# EAGLE schematic SMART_RAMPS_1-42 (EAGLE 6.1)
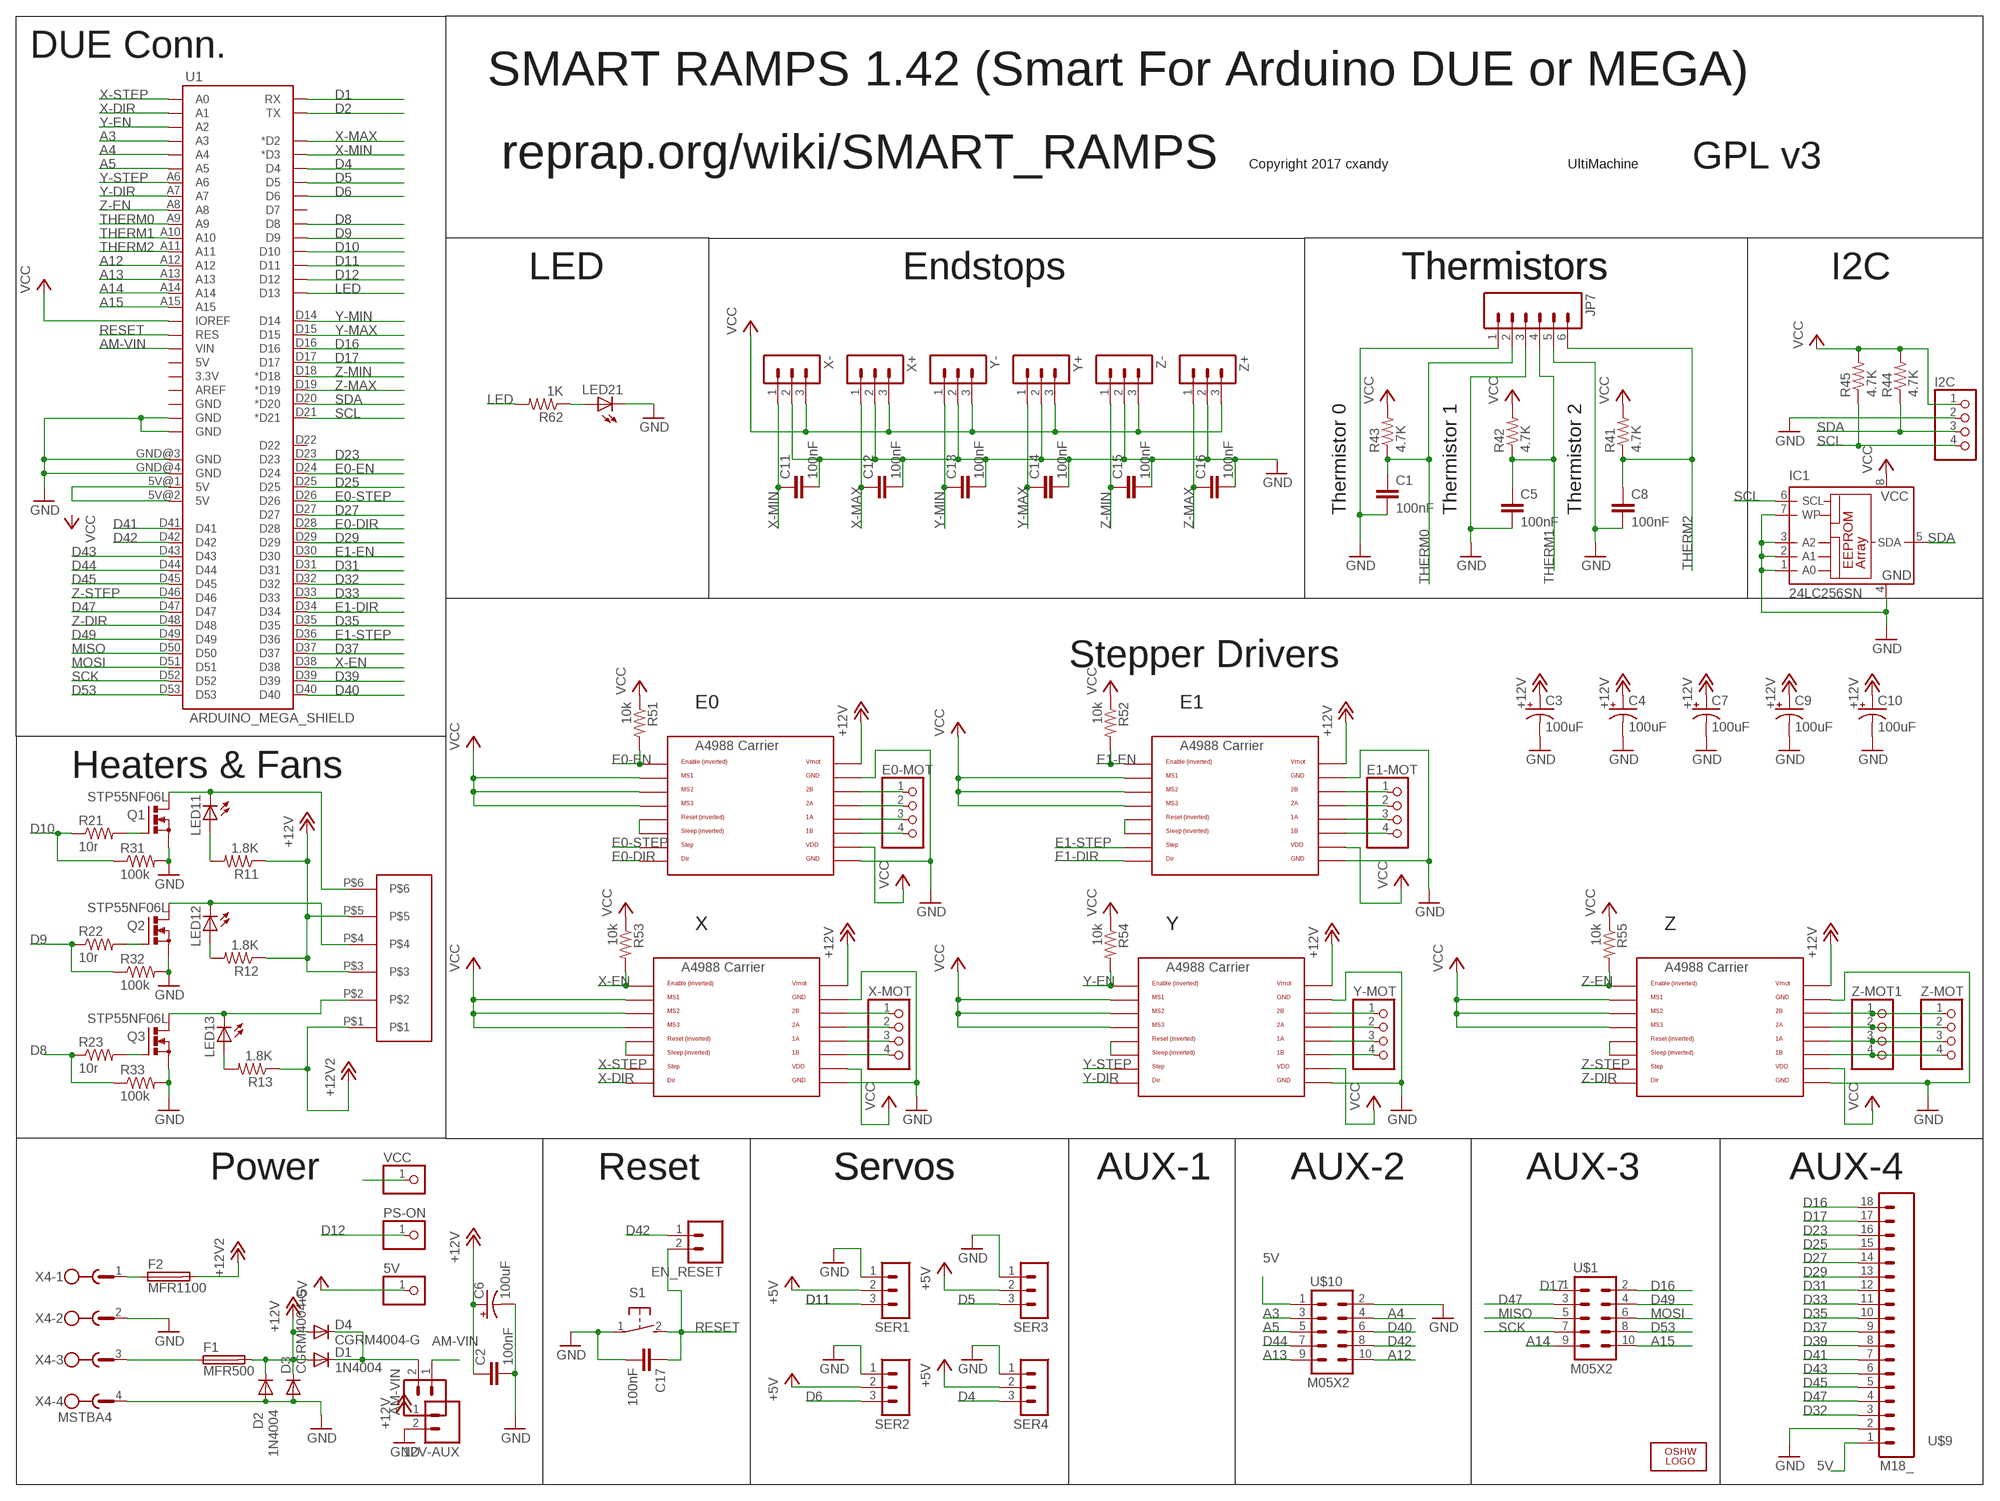
[diagram p0: schematic, sheet 1]

## Parts
5V  PINHD-1X1  [1X01]
12V-AUX  M02PTH  [1X02]
AM-VIN  M02PTH  [1X02]
C1  100nF  C-EUC0805K  [C0805K]
C2  100nF  C-EUC0805K  [C0805K]
C3  100uF  CPOL-US153CLV-0605  [153CLV-0605]
C4  100uF  CPOL-US153CLV-0605  [153CLV-0605]
C5  100nF  C-EUC0805K  [C0805K]
C6  100uF  CPOL-US153CLV-0605  [153CLV-0605]
C7  100uF  CPOL-US153CLV-0605  [153CLV-0605]
C8  100nF  C-EUC0805K  [C0805K]
C9  100uF  CPOL-US153CLV-0605  [153CLV-0605]
C10  100uF  CPOL-US153CLV-0605  [153CLV-0605]
C11  100nF  C-EUC0805K  [C0805K]
C12  100nF  C-EUC0805K  [C0805K]
C13  100nF  C-EUC0805K  [C0805K]
C14  100nF  C-EUC0805K  [C0805K]
C15  100nF  C-EUC0805K  [C0805K]
C16  100nF  C-EUC0805K  [C0805K]
C17  100nF  C-EUC0805K  [C0805K]
D1  1N4004  [DO41-10]
D2  1N4004  [DO41-10]
D3  CGRM4004-G  [SOD-123_MINI-SMA]
D4  CGRM4004-G  [SOD-123_MINI-SMA]
E0-MOT  PINHD-1X4  [1X04]
E1-MOT  PINHD-1X4  [1X04]
EN_RESET  M02PTH  [1X02]
F1  MFR500  REPRAPJR_PTCFUSE  [REPRAPJR_MFR500]
F2  MFR1100  REPRAPJR_PTCFUSEMFR1100  [REPRAPJR_MFR1100]
I2C  PINHD-1X4  [1X04]
IC1  24LC256SN  [SO-08]
JP7  M06SIP  [1X06]
LED11  LEDCHIP-LED0805  [CHIP-LED0805]
LED12  LEDCHIP-LED0805  [CHIP-LED0805]
LED13  LEDCHIP-LED0805  [CHIP-LED0805]
LED21  LEDCHIP-LED0805  [CHIP-LED0805]
LOGO1  OSHW_LOGO_6MILX0100-NT  [OSHW_6X100_NOTEXT]
PS-ON  PINHD-1X1  [1X01]
Q1  STP55NF06L  IRF512  [TO220BV]
Q2  STP55NF06L  IRF512  [TO220BV]
Q3  STP55NF06L  IRF512  [TO220BV]
R11  1.8K  R-US_R0805  [R0805]
R12  1.8K  R-US_R0805  [R0805]
R13  1.8K  R-US_R0805  [R0805]
R21  10r  R-US_R0805  [R0805]
R22  10r  R-US_R0805  [R0805]
R23  10r  R-US_R0805  [R0805]
R31  100k  R-US_R0805  [R0805]
R32  100k  R-US_R0805  [R0805]
R33  100k  R-US_R0805  [R0805]
R41  4.7K  R-US_R0805  [R0805]
R42  4.7K  R-US_R0805  [R0805]
R43  4.7K  R-US_R0805  [R0805]
R44  4.7K  R-US_R0805  [R0805]
R45  4.7K  R-US_R0805  [R0805]
R51  10k  R-US_R0805  [R0805]
R52  10k  R-US_R0805  [R0805]
R53  10k  R-US_R0805  [R0805]
R54  10k  R-US_R0805  [R0805]
R55  10k  R-US_R0805  [R0805]
R62  1K  R-US_R0805  [R0805]
S1  31-XX  [B3F-31XX]
SER1  3PIN-HEADER  [3PIN-HEADER]
SER2  3PIN-HEADER  [3PIN-HEADER]
SER3  3PIN-HEADER  [3PIN-HEADER]
SER4  3PIN-HEADER  [3PIN-HEADER]
U1  ARDUINO_MEGA_SHIELD  [ARDUINO_MEGA_SHIELD]
U$1  M05X2  [2X5]
U$2  282837-6  [282837-6]
U$4  A4988BREAKOUT  [A4988BREAKOUT]
U$5  A4988BREAKOUT  [A4988BREAKOUT]
U$6  A4988BREAKOUT  [A4988BREAKOUT]
U$7  A4988BREAKOUT  [A4988BREAKOUT]
U$8  A4988BREAKOUT  [A4988BREAKOUT]
U$9  M18_  [1X18]
U$10  M05X2  [2X5]
VCC  PINHD-1X1  [1X01]
X4  MSTBA4  [MSTBA4]
X+  3PIN-HEADER  [3PIN-HEADER]
X-  3PIN-HEADER  [3PIN-HEADER]
X-MOT  PINHD-1X4  [1X04]
Y+  3PIN-HEADER  [3PIN-HEADER]
Y-  3PIN-HEADER  [3PIN-HEADER]
Y-MOT  PINHD-1X4  [1X04]
Z+  3PIN-HEADER  [3PIN-HEADER]
Z-  3PIN-HEADER  [3PIN-HEADER]
Z-MOT  PINHD-1X4  [1X04]
Z-MOT1  PINHD-1X4  [1X04]

## Nets
5V: U$9.1 U$10.1 VCC.1
5V@1: U1.5V@1(5V) U1.5V@2(5V)
+5V: 5V.1 SER1.2 SER2.2 SER3.2 SER4.2
+12V: 12V-AUX.1 C2.1 C3.+ C4.+ C6.+ C7.+ C9.+ C10.+ D1.A D2.C D3.C D4.A F1.2 R11.1 R12.1 U$2.P$3 U$2.P$5 U$4.VMOT U$5.VMOT U$6.VMOT U$7.VMOT U$8.VMOT
+12V2: F2.2 R13.1 U$2.P$1
A3: U1.A3 U$10.3
A4: U1.A4 U$10.4
A5: U1.A5 U$10.5
A12: U1.A12 U$10.10
A13: U1.A13 U$10.9
A14: U1.A14 U$1.9
A15: U1.A15 U$1.10
AM-VIN: AM-VIN.1 U1.VIN
D1: U1.RX
D2: U1.TX
D4: SER4.3 U1.D4
D5: SER3.3 U1.D5
D6: SER2.3 U1.D6
D8: R23.1 R33.1 U1.D8
D9: R22.1 R32.1 U1.D9
D10: R21.1 R31.1 U1.D10
D11: SER1.3 U1.D11
D12: PS-ON.1 U1.D12
D16: U1.D16 U$1.2 U$9.18
D17: U1.D17 U$1.1 U$9.17
D23: U1.D23 U$9.16
D25: U1.D25 U$9.15
D27: U1.D27 U$9.14
D29: U1.D29 U$9.13
D31: U1.D31 U$9.12
D32: U1.D32 U$9.3
D33: U1.D33 U$9.11
D35: U1.D35 U$9.10
D37: U1.D37 U$9.9
D39: U1.D39 U$9.8
D40: U1.D40 U$10.6
D41: U1.D41 U$9.7
D42: EN_RESET.1 U1.D42 U$10.8
D43: U1.D43 U$9.6
D44: U1.D44 U$10.7
D45: U1.D45 U$9.5
D47: U1.D47 U$1.3 U$9.4
D49: U1.D49 U$1.4
D53: U1.D53 U$1.8
E0-DIR: U1.D28 U$4.DIR
E0-EN: R51.2 U1.D24 U$4.EN
E0-STEP: U1.D26 U$4.STEP
E1-DIR: U1.D34 U$5.DIR
E1-EN: R52.2 U1.D30 U$5.EN
E1-STEP: U1.D36 U$5.STEP
GND: 12V-AUX.2 C1.2 C2.2 C3.- C4.- C5.2 C6.- C7.- C8.2 C9.- C10.- C11.2 C12.2 C13.2 C14.2 C15.2 C16.2 C17.2 D2.A D3.A I2C.2 IC1.1(A0) IC1.2(A1) IC1.3(A2) IC1.4(GND) IC1.7(WP) JP7.1 JP7.3 JP7.5 LED21.C Q1.S Q2.S Q3.S R31.2 R32.2 R33.2 S1.1(P) SER1.1 SER2.1 SER3.1 SER4.1 U1.GND@0(GND) U1.GND@1(GND) U1.GND@3(GND) U1.GND@4(GND) U$4.GND U$4.GND@0(GND) U$5.GND U$5.GND@0(GND) U$6.GND U$6.GND@0(GND) U$7.GND U$7.GND@0(GND) U$8.GND U$8.GND@0(GND) U$9.2 U$10.2 X4.2 X4.4 X+.2 X-.2 Y+.2 Y-.2 Z+.2 Z-.2
LED: R62.2 U1.D13
MISO: U1.D50 U$1.5
MOSI: U1.D51 U$1.6
N$1: LED12.C Q2.D U$2.P$4
N$2: AM-VIN.2 D1.C D4.C
N$3: E0-MOT.1 U$4.2B
N$4: E0-MOT.2 U$4.2A
N$7: LED11.C Q1.D U$2.P$6
N$8: U$4.RST U$4.SLP(SLEEP)
N$10: E0-MOT.3 U$4.1A
N$11: E0-MOT.4 U$4.1B
N$12: E1-MOT.1 U$5.2B
N$13: E1-MOT.2 U$5.2A
N$16: E1-MOT.3 U$5.1A
N$18: E1-MOT.4 U$5.1B
N$20: U$6.RST U$6.SLP(SLEEP)
N$21: U$6.2B X-MOT.1
N$22: U$6.2A X-MOT.2
N$23: U$7.RST U$7.SLP(SLEEP)
N$24: U$5.RST U$5.SLP(SLEEP)
N$26: U$6.1A X-MOT.3
N$27: U$6.1B X-MOT.4
N$28: U$7.2B Y-MOT.1
N$29: U$7.2A Y-MOT.2
N$30: U$7.1A Y-MOT.3
N$32: LED13.A R13.2
N$36: U$7.1B Y-MOT.4
N$38: U$8.RST U$8.SLP(SLEEP)
N$41: U$8.2B Z-MOT1.1 Z-MOT.1
N$42: U$8.2A Z-MOT1.2 Z-MOT.2
N$43: U$8.1A Z-MOT1.3 Z-MOT.3
N$44: U$8.1B Z-MOT1.4 Z-MOT.4
N$45: LED12.A R12.2
N$46: LED21.A R62.1
N$47: Q2.G R22.2
N$48: Q1.G R21.2
N$49: Q3.G R23.2
N$50: LED11.A R11.2
N$51: LED13.C Q3.D U$2.P$2
N$53: F2.1 F2.3 X4.1
N$54: F1.1 F1.3 X4.3
RESET: C17.1 EN_RESET.2 S1.2(S) U1.RES
SCK: U1.D52 U$1.7
SCL: I2C.4 IC1.6(SCL) R45.1 U1.D21(*D21)
SDA: I2C.3 IC1.5(SDA) R44.1 U1.D20(*D20)
THERM0: C1.1 JP7.2 R43.1 U1.A9
THERM1: C5.1 JP7.4 R42.1 U1.A10
THERM2: C8.1 JP7.6 R41.1 U1.A11
VCC: I2C.1 IC1.8(VCC) R41.2 R42.2 R43.2 R44.2 R45.2 R51.1 R52.1 R53.1 R54.1 R55.1 U1.IOREF U$4.MS1 U$4.MS2 U$4.MS3 U$4.VDD U$5.MS1 U$5.MS2 U$5.MS3 U$5.VDD U$6.MS1 U$6.MS2 U$6.MS3 U$6.VDD U$7.MS1 U$7.MS2 U$7.MS3 U$7.VDD U$8.MS1 U$8.MS2 U$8.MS3 U$8.VDD X+.3 X-.3 Y+.3 Y-.3 Z+.3 Z-.3
X-DIR: U1.A1 U$6.DIR
X-EN: R53.2 U1.D38 U$6.EN
X-MAX: C12.1 U1.D2(*D2) X+.1
X-MIN: C11.1 U1.D3(*D3) X-.1
X-STEP: U1.A0 U$6.STEP
Y-DIR: U1.A7 U$7.DIR
Y-EN: R54.2 U1.A2 U$7.EN
Y-MAX: C14.1 U1.D15 Y+.1
Y-MIN: C13.1 U1.D14 Y-.1
Y-STEP: U1.A6 U$7.STEP
Z-DIR: U1.D48 U$8.DIR
Z-EN: R55.2 U1.A8 U$8.EN
Z-MAX: C16.1 U1.D19(*D19) Z+.1
Z-MIN: C15.1 U1.D18(*D18) Z-.1
Z-STEP: U1.D46 U$8.STEP
Unconnected: U1.3.3V U1.AREF U1.D7 U1.D22 U1.GND@2(GND)

## Notes on the sheet
- DUE Conn.
- SMART RAMPS 1.42 (Smart For Arduino DUE or MEGA)
- reprap.org/wiki/SMART_RAMPS | Copyright 2017 cxandy | UltiMachine | GPL v3
- LED | Endstops | Thermistors | Thermistors | I2C
- Thermistor 0 | Thermistor 1 | Thermistor 2
- Stepper Drivers
- E0 | E1
- Heaters & Fans
- X | Y | Z
- Power | Reset | Servos | Servos | AUX-1 | AUX-2 | AUX-3 | AUX-4

## Power pins joined to a net without a drawn wire
5V: U1.5V@0(5V)

## Library data of the parts
5V PS-ON VCC = adafruit:PINHD-1X1: Pin header 1x1 for 0.1" spacing With round pins
12V-AUX AM-VIN EN_RESET = SparkFun:M02: Header 2 Standard 2-pin 0.1" header. Use with straight break away headers (SKU : PRT-00116), right angle break away headers (PRT-00553), swiss pins (PRT-00743), machine pins (PRT-00117), and female headers (PRT-00115). Molex polarized connector foot print use with SKU : PRT-08233 with associated crimp pins and housings.
C1 C2 C5 C8 C11-C17 = resistor:C-EU: CAPACITOR, European symbol
C3 C4 C6 C7 C9 C10 = adafruit:CPOL-US: POLARIZED CAPACITOR, American symbol
D1 D2 = diode:1N4004: DIODE general purpose rectifier, 1 A
D3 D4 = diode:CGRM400*-G: Molded plasitc,JEDEC SOD-123/Mini SMA Source: Comchip CGRM4001-G.pdf
E0-MOT E1-MOT I2C X-MOT Y-MOT Z-MOT Z-MOT1 = RepRapjr:PINHD-1X4: PIN HEADER
F1 F2 = RAMPS_1-41:REPRAPJR_PTCFUSE: LITTLEFUSE Picofuse/slow Littlefuse
IC1 = microchip:24*: Serial EEPROM I2C; MF: MICROCHIP; MPN: 24LC256-I/SN; OC_FARNELL: 9757996; OC_NEWARK: 27C9144
JP7 = SparkFun:M06: Header 6 Standard 6-pin 0.1" header. Use with straight break away headers (SKU : PRT-00116), right angle break away headers (PRT-00553), swiss pins (PRT-00743), machine pins (PRT-00117), and female headers (PRT-00115). Molex polarized connector foot print use with SKU : PRT-08094 with associated crimp pins and housings. NOTES ON THE VARIANTS LOCK and LOCK_LONGPADS... This footprint was designed to help hold the alignment of a through-hole component (i.e. 6-pin header) while soldering it into place. You may notice that each hole has been shifted either up or down by 0.005 of an inch from it's more standard position (which is a perfectly straight line). This slight alteration caused the pins (the squares in the middle) to touch the edges of the holes. Because they are alternating, it causes a "brace" to hold the component in place. 0.005 has proven to be the perfect amount of "off-center" position when using our standard breakaway headers. Although looks a little odd when you look at the bare footprint, once you have a header in there, the alteration is very hard to notice. Also, if you push a header all the way into place, it is covered up entirely on the bottom side. This idea of altering the position of holes to aid alignment will be further integrated into the Sparkfun Library for other footprints. It can help hold any component with 3 or more connection pins.
LED11-LED13 LED21 = led:LED: LED OSRAM: - CHIPLED LG R971, LG N971, LY N971, LG Q971, LY Q971, LO R971, LY R971 LH N974, LH R974 LS Q976, LO Q976, LY Q976 LO Q996 - Hyper CHIPLED LW Q18S LB Q993, LB Q99A, LB R99A - SideLED LS A670, LO A670, LY A670, LG A670, LP A670 LB A673, LV A673, LT A673, LW A673 LH A674 LY A675 LS A676, LA A676, LO A676, LY A676, LW A676 LS A679, LY A679, LG A679 - Hyper Micro SIDELED® LS Y876, LA Y876, LO Y876, LY Y876 LT Y87S - SmartLED LW L88C, LW L88S LB L89C, LB L89S, LG L890 LS L89K, LO L89K, LY L89K LS L896, LA L896, LO L896, LY L896 - TOPLED LS T670, LO T670, LY T670, LG T670, LP T670 LSG T670, LSP T670, LSY T670, LOP T670, LYG T670 LG T671, LOG T671, LSG T671 LB T673, LV T673, LT T673, LW T673 LH T674 LS T676, LA T676, LO T676, LY T676, LB T676, LH T676, LSB T676, LW T676 LB T67C, LV T67C, LT T67C, LS T67K, LO T67K, LY T67K, LW E67C LS E67B, LA E67B, LO E67B, LY E67B, LB E67C, LV E67C, LT E67C LW T67C LS T679, LY T679, LG T679 LS T770, LO T770, LY T770, LG T770, LP T770 LB T773, LV T773, LT T773, LW T773 LH T774 LS E675, LA E675, LY E675, LS T675 LS T776, LA T776, LO T776, LY T776, LB T776 LHGB T686 LT T68C, LB T68C - Hyper Mini TOPLED® LB M676 - Mini TOPLED Santana® LG M470 LS M47K, LO M47K, LY M47K Source: http://www.osram.convergy.de LUXEON: - LUMILED® LXK2-PW12-R00, LXK2-PW12-S00, LXK2-PW14-U00, LXK2-PW14-V00 LXK2-PM12-R00, LXK2-PM12-S00, LXK2-PM14-U00 LXK2-PE12-Q00, LXK2-PE12-R00, LXK2-PE12-S00, LXK2-PE14-T00, LXK2-PE14-U00 LXK2-PB12-K00, LXK2-PB12-L00, LXK2-PB12-M00, LXK2-PB14-N00, LXK2-PB14-P00, LXK2-PB14-Q00 LXK2-PR12-L00, LXK2-PR12-M00, LXK2-PR14-Q00, LXK2-PR14-R00 LXK2-PD12-Q00, LXK2-PD12-R00, LXK2-PD12-S00 LXK2-PH12-R00, LXK2-PH12-S00 LXK2-PL12-P00, LXK2-PL12-Q00, LXK2-PL12-R00 Source: www.luxeon.com KINGBRIGHT: KA-3528ASYC Source: www.kingbright.com
LOGO1 = OSHW:OSHW_LOGO_6MIL
Q1-Q3 = transistor-power:IRF512: N-CHANNEL MOS FET
R11-R13 R21-R23 R31-R33 R41-R45 R51-R55 R62 = adafruit:R-US_: RESISTOR, American symbol
S1 = switch-omron:31-XX: OMRON SWITCH; MPN: B3F-3100; OC_FARNELL: 959704; OC_NEWARK: 36M3582
SER1-SER4 X+ X- Y+ Y- Z+ Z- = ultimachine:3PIN-HEADER: PIN HEADER
U1 = RepRapjr:ARDUINO_MEGA_SHIELD
U$1 U$10 = RepRapjr:M05X2
U$2 = RepRapjr:282837-6
U$4-U$8 = RepRapjr:A4988BREAKOUT
U$9 = SparkFun:M18
X4 = con-phoenix-508:MSTBA4: PHOENIX